# Altium schematic sheet SPI-CAN Converter.SchDoc
size A4
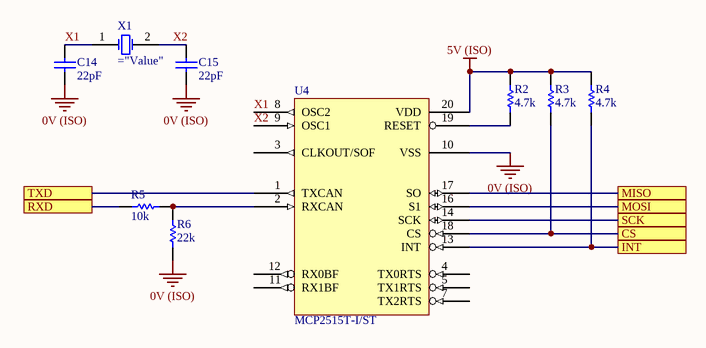
[diagram p0: SPI-CAN Converter.SchDoc]

## Parts
C14  22pF  [0805]
C15  22pF  [0805]
R2  4.7k  [0805]
R3  4.7k  [0805]
R4  4.7k  [0805]
R5  10k  [0805]
R6  22k  [0805]
U4  MCP2515T-I/ST  [MCP 20-TSSOP]
X1  (no value)  [Abracon HC-49/US]

## Ports
CS, INT, MISO, MOSI, RXD, SCK, TXD

## Nets
0V (ISO): C14.1 C15.1 R6.1 U4.10(VSS)
5V (ISO): R2.2 R3.2 R4.2 U4.20(VDD)
CS: R3.1 U4.18(CS) ; port CS
INT: R4.1 U4.13(INT) ; port INT
MISO: U4.17(SO) ; port MISO
MOSI: U4.16(S1) ; port MOSI
RXD: R5.1 ; port RXD
SCK: U4.14(SCK) ; port SCK
TXD: U4.1(TXCAN) ; port TXD
X1: C14.2 U4.8(OSC2) X1.1(OSC1)
X2: C15.2 U4.9(OSC1) X1.2(OSC2)
NetR2_1: R2.1 U4.19(RESET)
NetR5_2: R5.2 R6.2 U4.2(RXCAN)

Not connected (* = marked no-connect by the designer): U4 3(CLKOUT/SOF) 4(TX0RTS) 5(TX1RTS) 7(TX2RTS) 11(RX1BF) 12(RX0BF)

## Library data of the parts
C14 C15 = GRM21A5C2E220JW01D: Manufacturer: muRata; Tolerance: ±5%; Material: C0G, NP0; Rated Voltage: 250V; Part Number: GRM21A5C2E220JW01D; Value: 22pF; Digikey Part Number: 490-5534-1-ND
R2-R4 = RC0805FR074K7L: Manufacturer: YAGEO; Tolerance: 0.01; Rated Voltage: 0.125W; Part Number: RC0805FR074K7L; Value: 4.7k; Material: FR-07; Digikey Part Number: 311-4.70KCRCT-ND
R5 = RC0805FR0710KL: Manufacturer: YAGEO; Tolerance: 0.01; Rated Voltage: 0.125W; Part Number: RC0805FR0710KL; Value: 10k; Material: FR-07; Digikey Part Number: 311-10.0KCRCT-ND
R6 = RC0805FR0722KL: Manufacturer: YAGEO; Tolerance: 0.01; Rated Voltage: 0.125W; Part Number: RC0805FR0722KL; Value: 22k; Material: FR-07; Digikey Part Number: 311-22.0KCRCT-ND
U4 = MCP2515T-I/ST: CANbus Controller CAN 2.0 SPI Interface 20-TSSOP; Manufacturer: Microchip Technology; Part Number: MCP2515T-I/ST; Digikey Part Number: MCP2515T-I/STCT-ND; Digikey Link: https://www.digikey.com/product-detail/en/microchip-technology/MCP2515T-I-ST/MCP2515T-I-STCT-ND/4307903
X1 = ABLS-16.000MHZ-B4-T: Manufacturer: Abracon LLC; Load Capacitance: 18pF; ESR: 40R; Part Number: ABLS-16.000MHZ-B4-T; Digikey Part Number: 535-10226-1-ND; Digikey Link: https://www.digikey.com/product-detail/en/abracon-llc/ABLS-16.000MHZ-B4-T/535-10226-1-ND/2184261